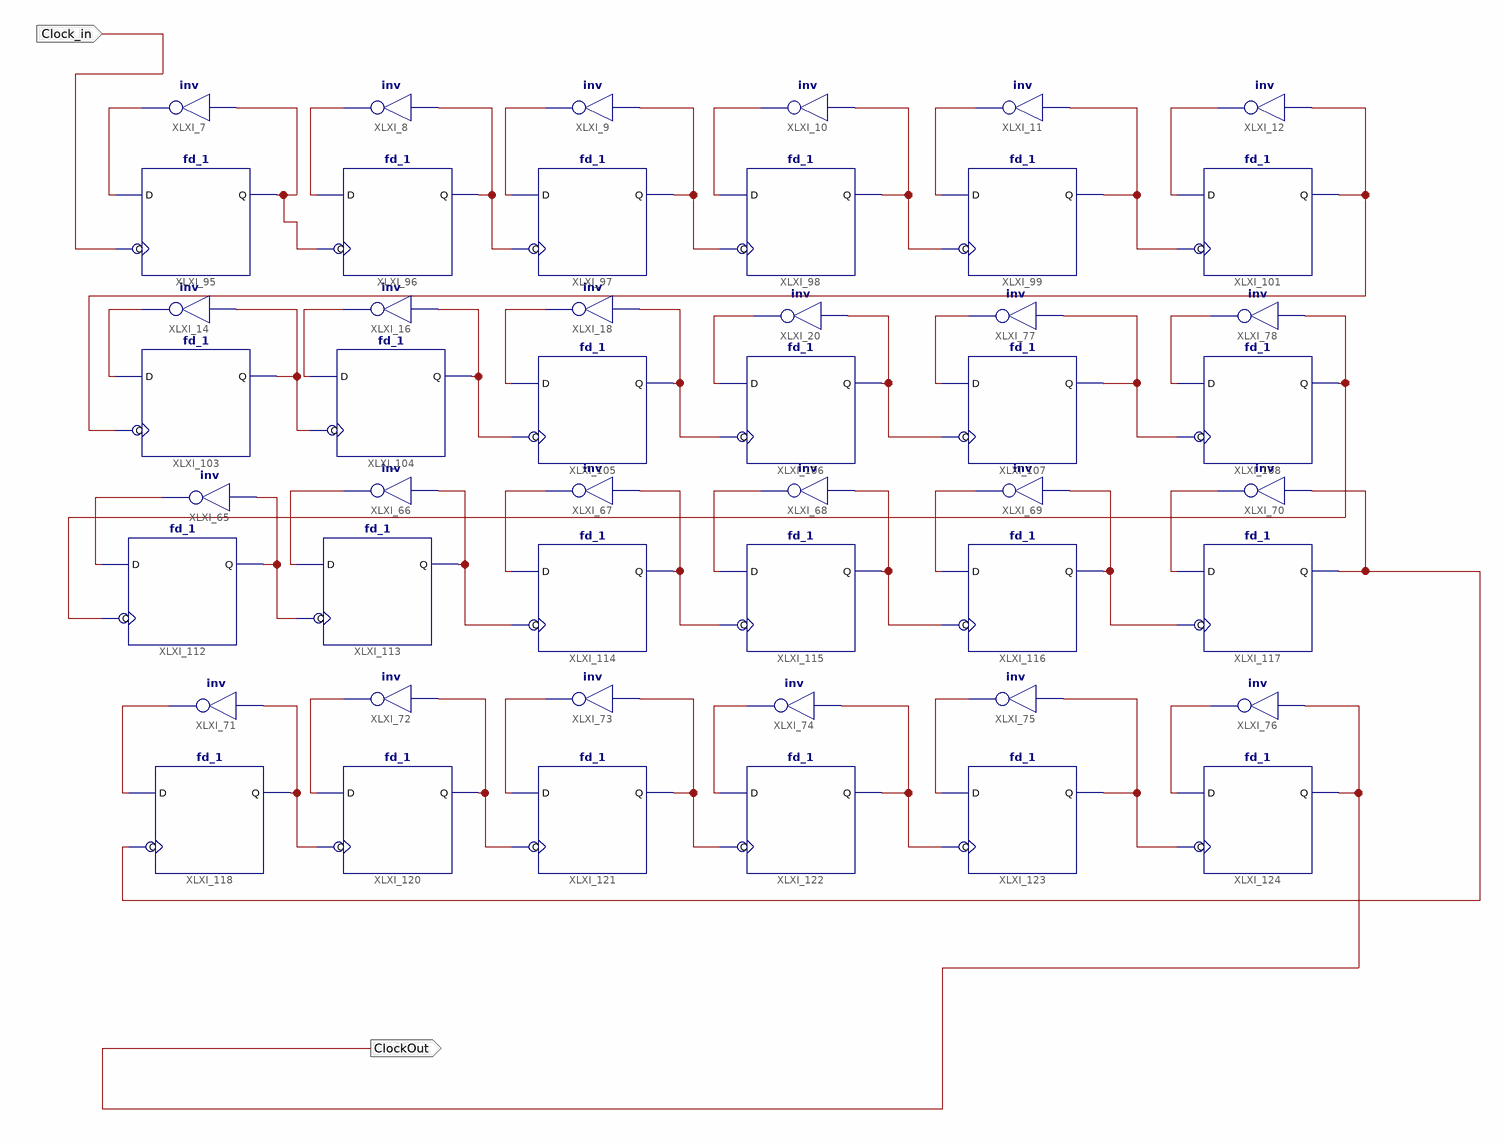
[diagram p0: schematic sheet 1]
// Xilinx ISE schematic TimeClock.sch (spartan6) as structural Verilog: 48 symbols, 2 ports
module TimeClock (
  input  Clock_in,
  output ClockOut
);

  wire XLXN_2, XLXN_3, XLXN_4, XLXN_5, XLXN_7, XLXN_8, XLXN_9, XLXN_10, XLXN_11, XLXN_14, XLXN_15, XLXN_16,
       XLXN_17, XLXN_19, XLXN_21, XLXN_96, XLXN_101, XLXN_108, XLXN_110, XLXN_112, XLXN_113, XLXN_114,
       XLXN_115, XLXN_116, XLXN_117, XLXN_118, XLXN_122, XLXN_123, XLXN_124, XLXN_134, XLXN_137, XLXN_138,
       XLXN_140, XLXN_141, XLXN_142, XLXN_145, XLXN_146, XLXN_148, XLXN_149, XLXN_150, XLXN_152, XLXN_153,
       XLXN_155, XLXN_156, XLXN_157, XLXN_183, XLXN_184;

  not XLXI_7 (XLXN_183, XLXN_184);
  not XLXI_8 (XLXN_7, XLXN_2);
  not XLXI_9 (XLXN_8, XLXN_3);
  not XLXI_10 (XLXN_9, XLXN_4);
  not XLXI_11 (XLXN_10, XLXN_5);
  not XLXI_12 (XLXN_11, XLXN_14);
  not XLXI_14 (XLXN_16, XLXN_15);
  not XLXI_16 (XLXN_17, XLXN_96);
  not XLXI_18 (XLXN_19, XLXN_101);
  not XLXI_20 (XLXN_21, XLXN_108);
  not XLXI_65 (XLXN_134, XLXN_113);
  not XLXI_66 (XLXN_137, XLXN_114);
  not XLXI_67 (XLXN_138, XLXN_115);
  not XLXI_68 (XLXN_140, XLXN_116);
  not XLXI_69 (XLXN_141, XLXN_117);
  not XLXI_70 (XLXN_142, XLXN_118);
  not XLXI_71 (XLXN_146, XLXN_145);
  not XLXI_72 (XLXN_149, XLXN_148);
  not XLXI_73 (XLXN_150, XLXN_122);
  not XLXI_74 (XLXN_152, XLXN_123);
  not XLXI_75 (XLXN_153, XLXN_124);
  not XLXI_76 (XLXN_155, ClockOut);
  not XLXI_77 (XLXN_156, XLXN_110);
  not XLXI_78 (XLXN_157, XLXN_112);
  fd_1 XLXI_96 (.C(XLXN_184), .D(XLXN_7), .Q(XLXN_2));
  fd_1 XLXI_97 (.C(XLXN_2), .D(XLXN_8), .Q(XLXN_3));
  fd_1 XLXI_98 (.C(XLXN_3), .D(XLXN_9), .Q(XLXN_4));
  fd_1 XLXI_99 (.C(XLXN_4), .D(XLXN_10), .Q(XLXN_5));
  fd_1 XLXI_101 (.C(XLXN_5), .D(XLXN_11), .Q(XLXN_14));
  fd_1 XLXI_95 (.C(Clock_in), .D(XLXN_183), .Q(XLXN_184));
  fd_1 XLXI_103 (.C(XLXN_14), .D(XLXN_16), .Q(XLXN_15));
  fd_1 XLXI_104 (.C(XLXN_15), .D(XLXN_17), .Q(XLXN_96));
  fd_1 XLXI_105 (.C(XLXN_96), .D(XLXN_19), .Q(XLXN_101));
  fd_1 XLXI_106 (.C(XLXN_101), .D(XLXN_21), .Q(XLXN_108));
  fd_1 XLXI_107 (.C(XLXN_108), .D(XLXN_156), .Q(XLXN_110));
  fd_1 XLXI_108 (.C(XLXN_110), .D(XLXN_157), .Q(XLXN_112));
  fd_1 XLXI_112 (.C(XLXN_112), .D(XLXN_134), .Q(XLXN_113));
  fd_1 XLXI_113 (.C(XLXN_113), .D(XLXN_137), .Q(XLXN_114));
  fd_1 XLXI_114 (.C(XLXN_114), .D(XLXN_138), .Q(XLXN_115));
  fd_1 XLXI_115 (.C(XLXN_115), .D(XLXN_140), .Q(XLXN_116));
  fd_1 XLXI_116 (.C(XLXN_116), .D(XLXN_141), .Q(XLXN_117));
  fd_1 XLXI_117 (.C(XLXN_117), .D(XLXN_142), .Q(XLXN_118));
  fd_1 XLXI_118 (.C(XLXN_118), .D(XLXN_146), .Q(XLXN_145));
  fd_1 XLXI_120 (.C(XLXN_145), .D(XLXN_149), .Q(XLXN_148));
  fd_1 XLXI_121 (.C(XLXN_148), .D(XLXN_150), .Q(XLXN_122));
  fd_1 XLXI_122 (.C(XLXN_122), .D(XLXN_152), .Q(XLXN_123));
  fd_1 XLXI_123 (.C(XLXN_123), .D(XLXN_153), .Q(XLXN_124));
  fd_1 XLXI_124 (.C(XLXN_124), .D(XLXN_155), .Q(ClockOut));
endmodule
